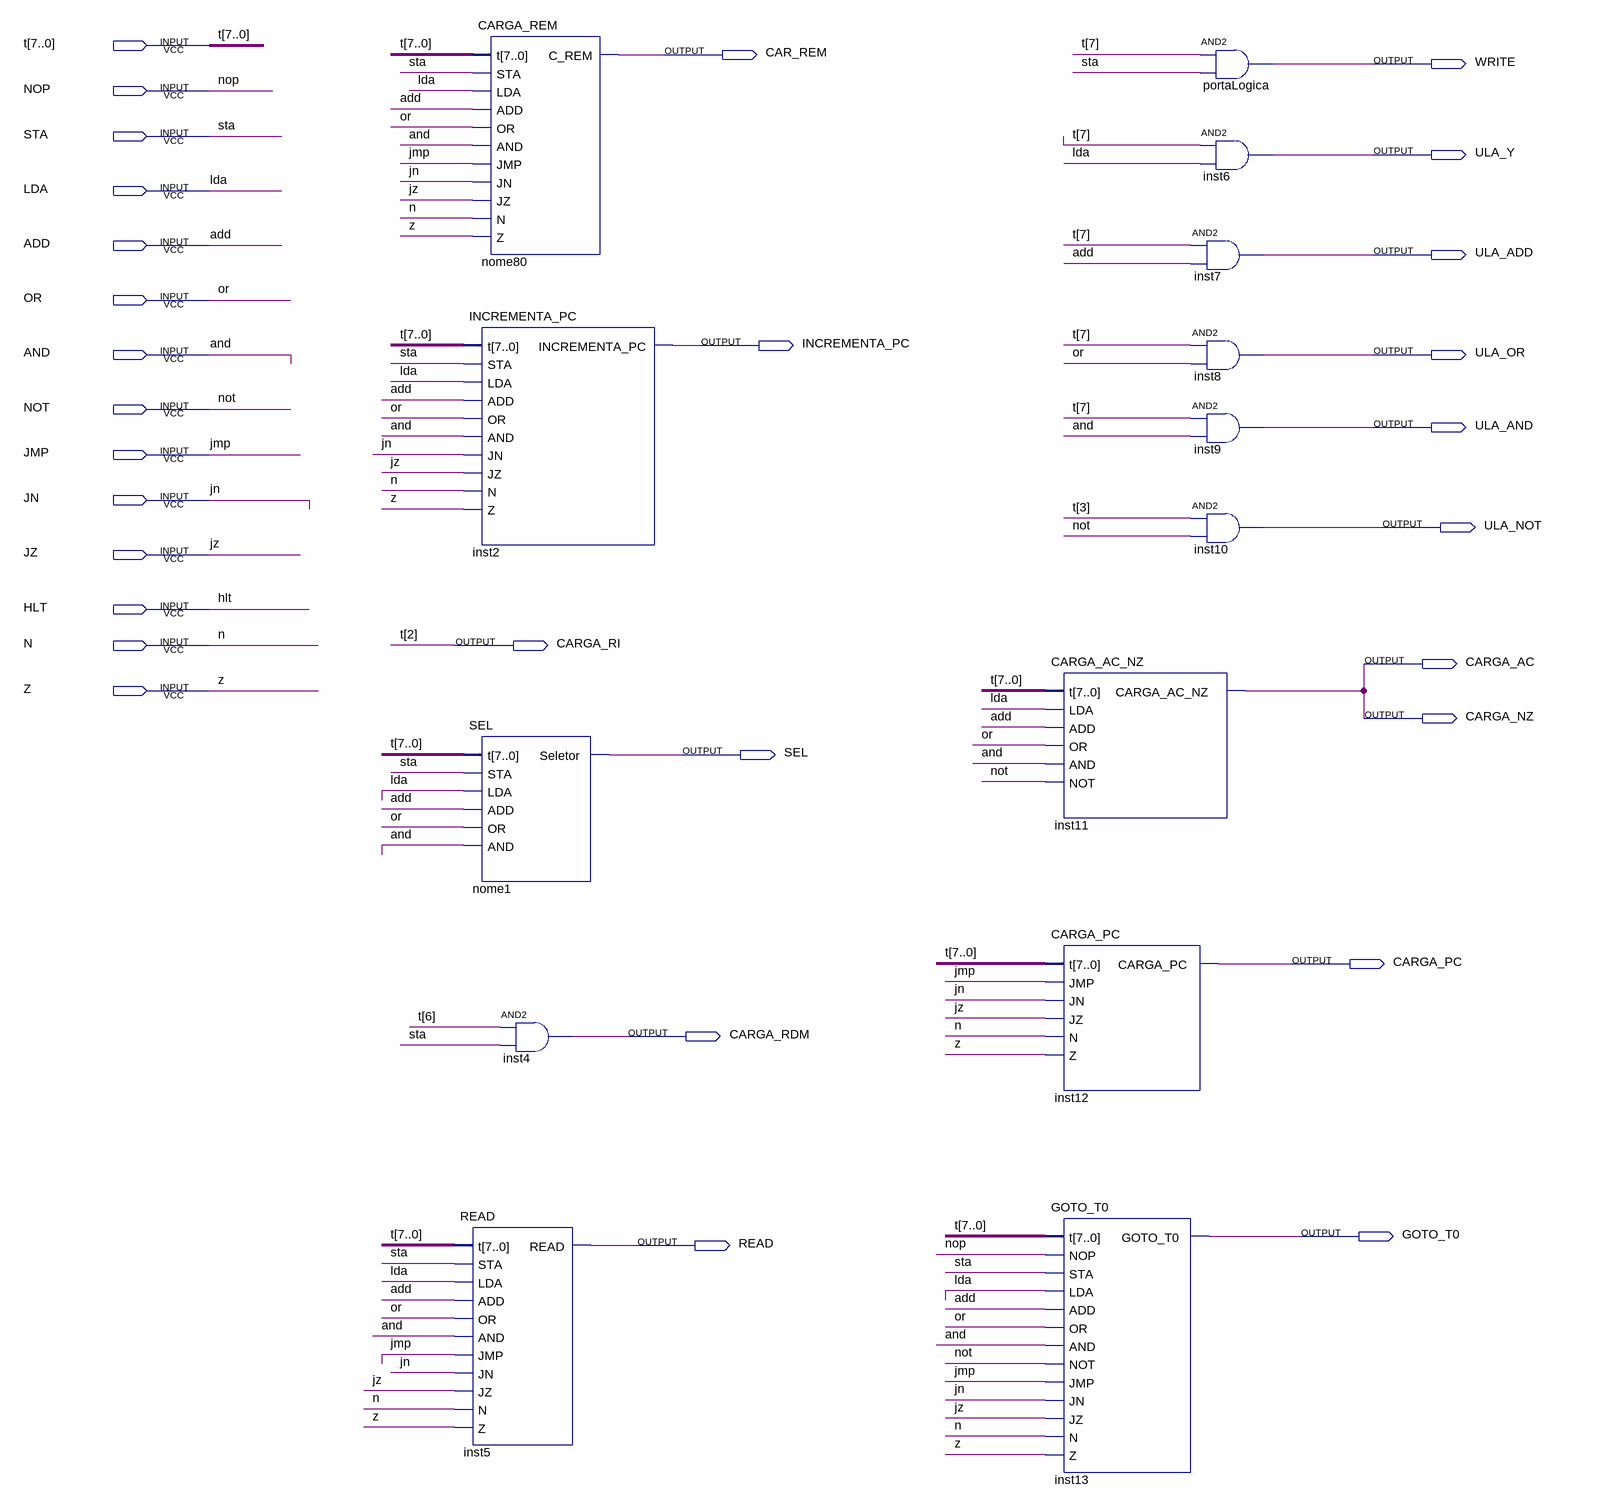
[diagram p0: schematic sheet]
// Quartus schematic CONTROL_UNIT.bdf as structural Verilog: 14 symbols, 30 pins
module CONTROL_UNIT (
  input  [7:0] t,
  input  NOP,
  input  STA,
  input  LDA,
  input  ADD,
  input  OR,
  input  AND,
  input  NOT,
  input  JMP,
  input  JN,
  input  JZ,
  input  HLT,
  input  N,
  input  Z,
  output CAR_REM,
  output WRITE,
  output ULA_Y,
  output ULA_ADD,
  output INCREMENTA_PC,
  output ULA_OR,
  output ULA_AND,
  output ULA_NOT,
  output CARGA_RI,
  output CARGA_AC,
  output CARGA_NZ,
  output SEL,
  output CARGA_PC,
  output CARGA_RDM,
  output GOTO_T0,
  output READ
);

  CARGA_REM nome80 (
    .t(t), .STA(STA), .LDA(LDA), .ADD(ADD), .OR(OR), .AND(AND), .JMP(JMP), .JN(JN), .JZ(JZ), .N(N), .Z(Z),
    .C_REM(CAR_REM));
  INCREMENTA_PC inst2 (
    .t(t), .STA(STA), .LDA(LDA), .ADD(ADD), .OR(OR), .AND(AND), .JN(JN), .JZ(JZ), .N(N), .Z(Z),
    .INCREMENTA_PC(INCREMENTA_PC));
  SEL nome1 (.t(t), .STA(STA), .LDA(LDA), .ADD(ADD), .OR(OR), .AND(AND), .Seletor(SEL));
  READ inst5 (
    .t(t), .STA(STA), .LDA(LDA), .ADD(ADD), .OR(OR), .AND(AND), .JMP(JMP), .JN(JN), .JZ(JZ), .N(N), .Z(Z),
    .READ(READ));
  and inst4 (CARGA_RDM, t[6], STA);
  CARGA_AC_NZ inst11 (.t(t), .LDA(LDA), .ADD(ADD), .OR(OR), .AND(AND), .NOT(NOT), .CARGA_AC_NZ(CARGA_AC));
  CARGA_PC inst12 (.t(t), .JMP(JMP), .JN(JN), .JZ(JZ), .N(N), .Z(Z), .CARGA_PC(CARGA_PC));
  GOTO_T0 inst13 (
    .t(t), .NOP(NOP), .STA(STA), .LDA(LDA), .ADD(ADD), .OR(OR), .AND(AND), .NOT(NOT), .JMP(JMP), .JN(JN),
    .JZ(JZ), .N(N), .Z(Z), .GOTO_T0(GOTO_T0));
  and portaLogica (WRITE, t[7], STA);
  and inst6 (ULA_Y, t[7], LDA);
  and inst7 (ULA_ADD, t[7], ADD);
  and inst8 (ULA_OR, t[7], OR);
  and inst9 (ULA_AND, t[7], AND);
  and inst10 (ULA_NOT, t[3], NOT);

  assign CARGA_NZ = CARGA_AC;
  assign CARGA_RI = t[2];
endmodule
